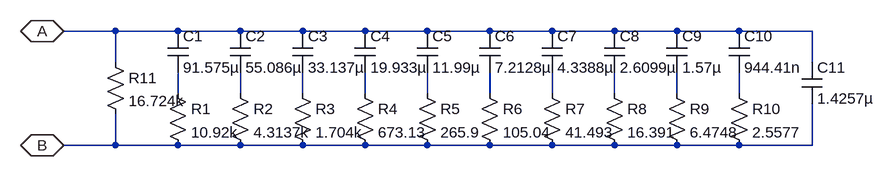
[diagram p0: schematic CPE2.asc]
CPE2.asc, the LTspice schematic file:
Version 4
SHEET 1 1212 680
WIRE 32 0 -48 0
WIRE 128 0 32 0
WIRE 224 0 128 0
WIRE 320 0 224 0
WIRE 416 0 320 0
WIRE 512 0 416 0
WIRE 608 0 512 0
WIRE 704 0 608 0
WIRE 800 0 704 0
WIRE 896 0 800 0
WIRE 992 0 896 0
WIRE 1104 0 992 0
WIRE 32 48 32 0
WIRE 1104 48 1104 0
WIRE 128 96 128 64
WIRE 224 96 224 64
WIRE 320 96 320 64
WIRE 416 96 416 64
WIRE 512 96 512 64
WIRE 608 96 608 64
WIRE 704 96 704 64
WIRE 800 96 800 64
WIRE 896 96 896 64
WIRE 992 96 992 64
WIRE 32 176 32 128
WIRE 32 176 -48 176
WIRE 128 176 32 176
WIRE 224 176 128 176
WIRE 320 176 224 176
WIRE 416 176 320 176
WIRE 512 176 416 176
WIRE 608 176 512 176
WIRE 704 176 608 176
WIRE 800 176 704 176
WIRE 896 176 800 176
WIRE 992 176 896 176
WIRE 1104 176 1104 112
WIRE 1104 176 992 176
FLAG -48 0 A
IOPIN -48 0 BiDir
FLAG -48 176 B
IOPIN -48 176 BiDir
SYMBOL res 112 80 R0
SYMATTR InstName R1
SYMATTR Value 10.92k
SYMBOL res 208 80 R0
SYMATTR InstName R2
SYMATTR Value 4.3137k
SYMBOL res 304 80 R0
SYMATTR InstName R3
SYMATTR Value 1.704k
SYMBOL res 400 80 R0
SYMATTR InstName R4
SYMATTR Value 673.13
SYMBOL res 496 80 R0
SYMATTR InstName R5
SYMATTR Value 265.9
SYMBOL res 592 80 R0
SYMATTR InstName R6
SYMATTR Value 105.04
SYMBOL res 688 80 R0
SYMATTR InstName R7
SYMATTR Value 41.493
SYMBOL res 784 80 R0
SYMATTR InstName R8
SYMATTR Value 16.391
SYMBOL res 880 80 R0
SYMATTR InstName R9
SYMATTR Value 6.4748
SYMBOL res 976 80 R0
SYMATTR InstName R10
SYMATTR Value 2.5577
SYMBOL cap 112 0 R0
SYMATTR InstName C1
SYMATTR Value 91.575µ
SYMBOL cap 208 0 R0
SYMATTR InstName C2
SYMATTR Value 55.086µ
SYMBOL cap 304 0 R0
SYMATTR InstName C3
SYMATTR Value 33.137µ
SYMBOL cap 400 0 R0
SYMATTR InstName C4
SYMATTR Value 19.933µ
SYMBOL cap 496 0 R0
SYMATTR InstName C5
SYMATTR Value 11.99µ
SYMBOL cap 592 0 R0
SYMATTR InstName C6
SYMATTR Value 7.2128µ
SYMBOL cap 688 0 R0
SYMATTR InstName C7
SYMATTR Value 4.3388µ
SYMBOL cap 784 0 R0
SYMATTR InstName C8
SYMATTR Value 2.6099µ
SYMBOL cap 880 0 R0
SYMATTR InstName C9
SYMATTR Value 1.57µ
SYMBOL cap 976 0 R0
SYMATTR InstName C10
SYMATTR Value 944.41n
SYMBOL cap 1088 48 R0
SYMATTR InstName C11
SYMATTR Value 1.4257µ
SYMBOL res 16 32 R0
SYMATTR InstName R11
SYMATTR Value 16.724k

The netlist it stands for:
* CPE2.asc
R1 N001 B 10.92k
R2 N002 B 4.3137k
R3 N003 B 1.704k
R4 N004 B 673.13
R5 N005 B 265.9
R6 N006 B 105.04
R7 N007 B 41.493
R8 N008 B 16.391
R9 N009 B 6.4748
R10 N010 B 2.5577
C1 A N001 91.575µ
C2 A N002 55.086µ
C3 A N003 33.137µ
C4 A N004 19.933µ
C5 A N005 11.99µ
C6 A N006 7.2128µ
C7 A N007 4.3388µ
C8 A N008 2.6099µ
C9 A N009 1.57µ
C10 A N010 944.41n
C11 A B 1.4257µ
R11 A B 16.724k
.backanno
.end